# EAGLE design ESP32-Mini1-OSHPARK (EAGLE 9.6.2)
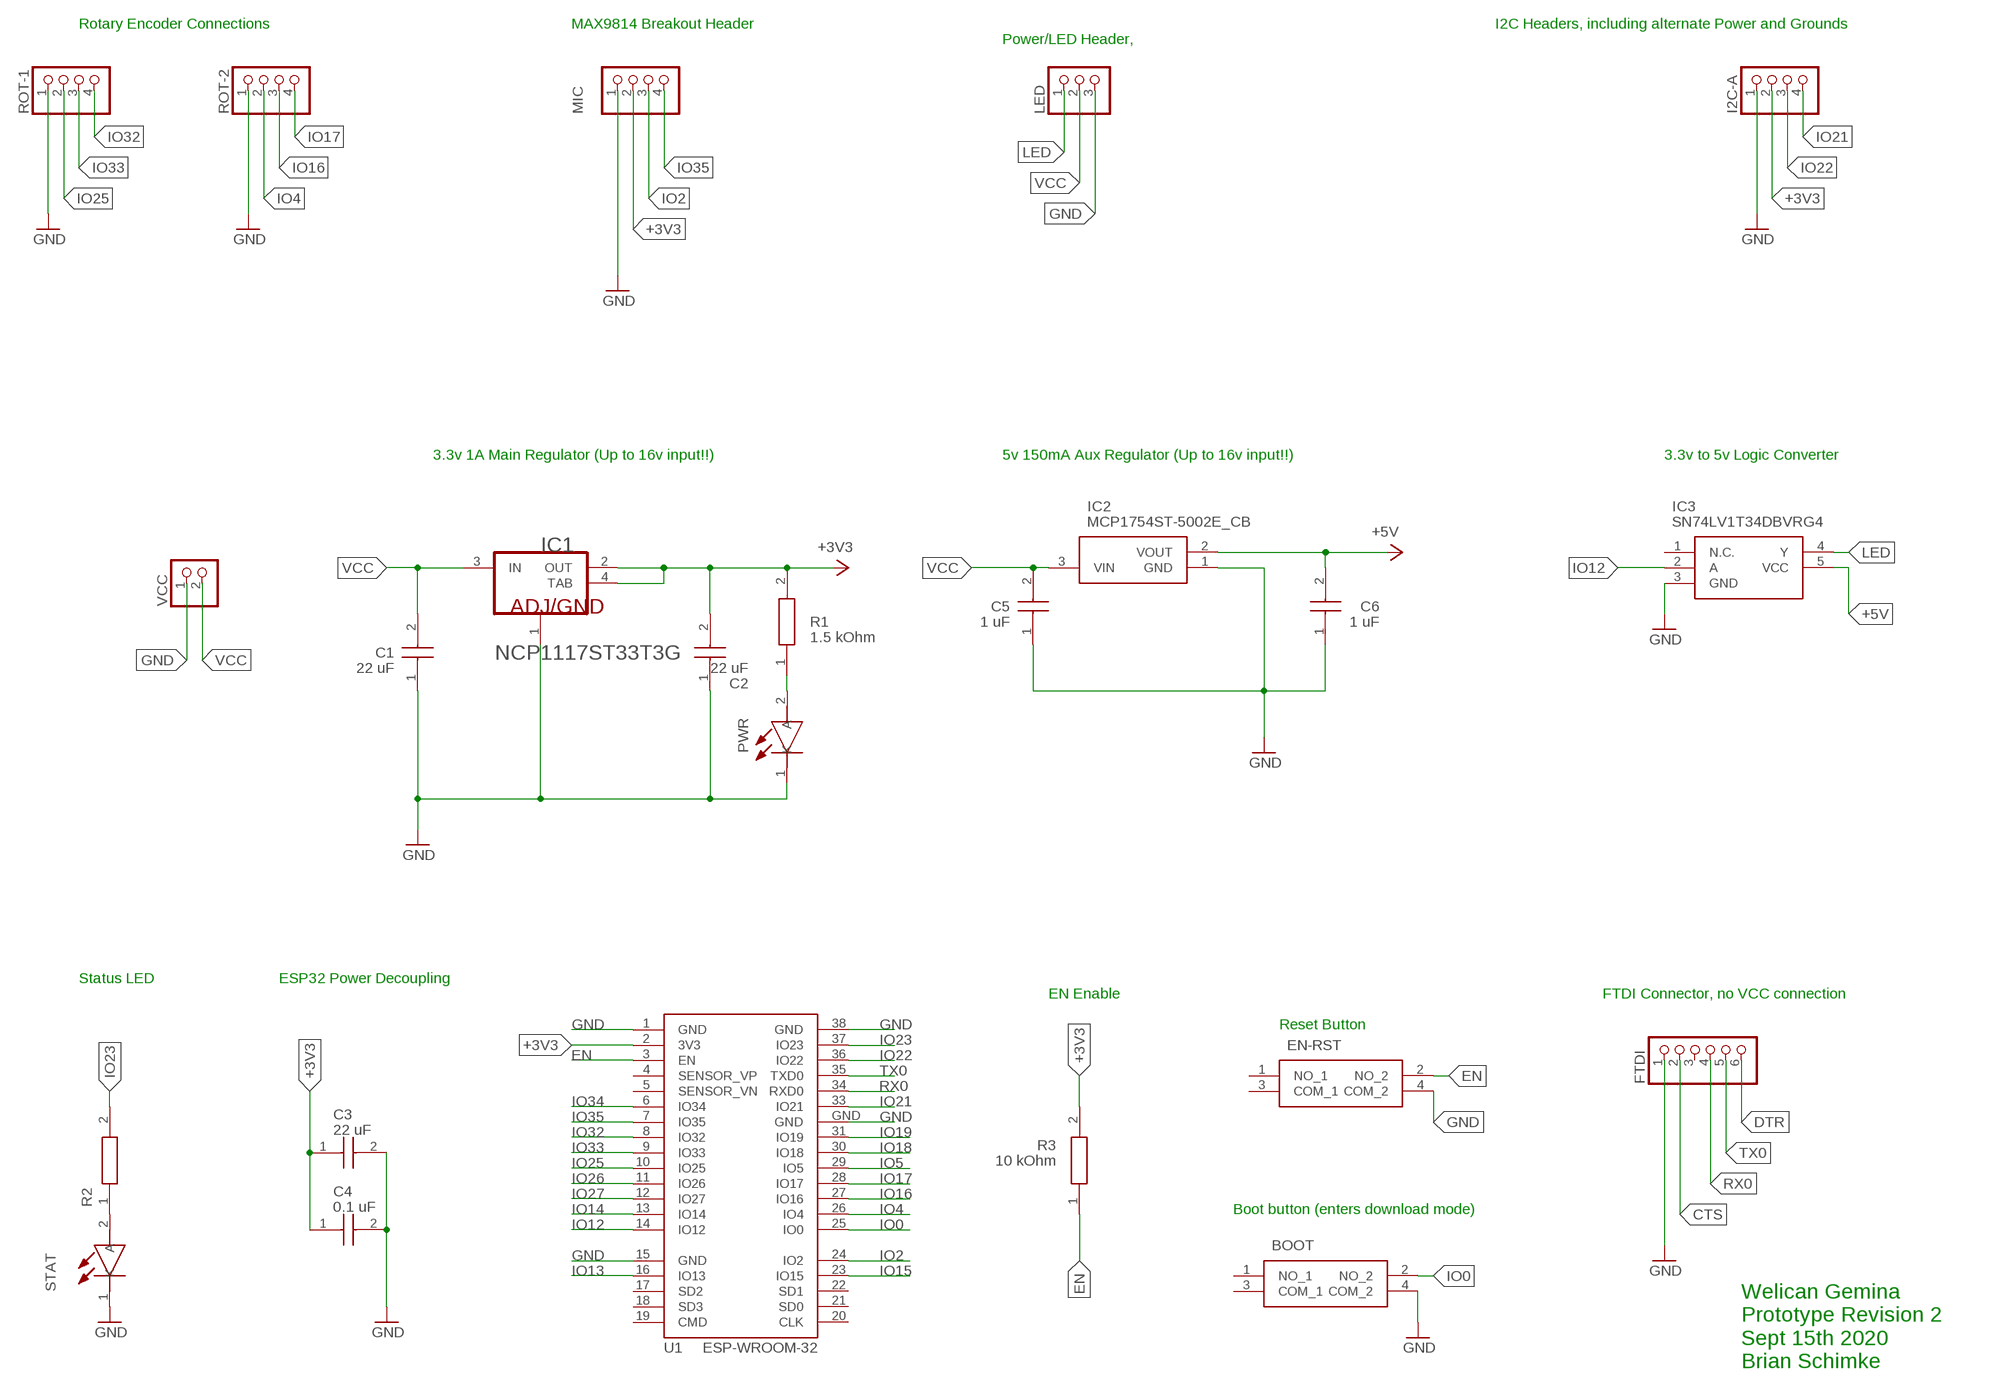
[diagram p0: schematic, sheet 1]

## Parts
BOOT  PTS647SK70SMTR2LFS  [PTS647SK70SMTR2LFS]
C1  22 uF  C1206C226M4PACTU  [CAPC3216X180N]
C2  22 uF  C1206C226M4PACTU  [CAPC3216X180N]
C3  22 uF  C1206C226M4PACTU  [CAPC3216X180N]
C4  0.1 uF  C1206C226M4PACTU  [CAPC3216X180N]
C5  1 uF  C1206C226M4PACTU  [CAPC3216X180N]
C6  1 uF  C1206C226M4PACTU  [CAPC3216X180N]
EN-RST  PTS647SK70SMTR2LFS  [PTS647SK70SMTR2LFS]
FTDI  PINHD-1X6  [1X06]
I2C-A  PINHD-1X4  [1X04]
IC1  ON_SEMICONDUCTOR_NCP1117ST33T3GON_SEMICONDUCTOR_NCP1117ST33T3G_0_0  [ON_SEMICONDUCTOR_NCP1117ST33T3G_0]
IC2  MCP1754ST-5002E_CB  [SOT95P255X145-3N]
IC3  SN74LV1T34DBVRG4  [SOT95P280X145-5N]
LED  PINHD-1X3  [1X03]
MIC  PINHD-1X4  [1X04]
PWR  150120AS75000  [LEDSC320X160X78-2N]
R1  1.5 kOhm  CRCW12061K00FKEB  [RESC3216X60N]
R2  CRCW12061K00FKEB  [RESC3216X60N]
R3  10 kOhm  CRCW12061K00FKEB  [RESC3216X60N]
ROT-1  PINHD-1X4  [1X04]
ROT-2  PINHD-1X4  [1X04]
STAT  150120AS75000  [LEDSC320X160X78-2N]
U1  ESP-WROOM-32  [ESP-WROOM-32]
VCC  PINHD-1X2  [1X02]

## Nets
+3V3: C2.2 C3.1 C4.1 I2C-A.2 IC1.2(OUT) IC1.4(TAB) MIC.2 R1.2 R3.2 U1.2(3V3)
+5V: C6.2 IC2.2(VOUT) IC3.5(VCC)
CTS: FTDI.2
DTR: FTDI.6
EN: EN-RST.2(NO_2) R3.1 U1.3(EN)
GND: BOOT.4(COM_2) C1.1 C2.1 C3.2 C4.2 C5.1 C6.1 EN-RST.4(COM_2) FTDI.1 I2C-A.1 IC1.1(ADJ/GND) IC2.1(GND) IC3.3(GND) LED.3 MIC.1 PWR.1(K) ROT-1.1 ROT-2.1 STAT.1(K) U1.1(GND) U1.15(GND) U1.38(GND) U1.GND VCC.1
IO0: BOOT.2(NO_2) U1.25(IO0)
IO2: MIC.3 U1.24(IO2)
IO4: ROT-2.2 U1.26(IO4)
IO5: U1.29(IO5)
IO12: IC3.2(A) U1.14(IO12)
IO13: U1.16(IO13)
IO14: U1.13(IO14)
IO15: U1.23(IO15)
IO16: ROT-2.3 U1.27(IO16)
IO17: ROT-2.4 U1.28(IO17)
IO18: U1.30(IO18)
IO19: U1.31(IO19)
IO21: I2C-A.4 U1.33(IO21)
IO22: I2C-A.3 U1.36(IO22)
IO23: R2.2 U1.37(IO23)
IO25: ROT-1.2 U1.10(IO25)
IO26: U1.11(IO26)
IO27: U1.12(IO27)
IO32: ROT-1.4 U1.8(IO32)
IO33: ROT-1.3 U1.9(IO33)
IO34: U1.6(IO34)
IO35: MIC.4 U1.7(IO35)
LED: IC3.4(Y) LED.1
N$1: PWR.2(A) R1.1
N$2: R2.1 STAT.2(A)
RX0: FTDI.4 U1.34(RXD0)
TX0: FTDI.5 U1.35(TXD0)
VCC: C1.2 C5.2 IC1.3(IN) IC2.3(VIN) LED.2 VCC.2
Unconnected: BOOT.1(NO_1) BOOT.3(COM_1) EN-RST.1(NO_1) EN-RST.3(COM_1) FTDI.3 IC3.1(N.C.) U1.4(SENSOR_VP) U1.5(SENSOR_VN) U1.17(SD2) U1.18(SD3) U1.19(CMD) U1.20(CLK) U1.21(SD0) U1.22(SD1)

## Notes on the sheet
- Rotary Encoder Connections | MAX9814 Breakout Header | I2C Headers, including alternate Power and Grounds
- Power/LED Header,
- 3.3v 1A Main Regulator (Up to 16v input!!) | 5v 150mA Aux Regulator (Up to 16v input!!) | 3.3v to 5v Logic Converter
- Status LED | ESP32 Power Decoupling
- EN Enable | FTDI Connector, no VCC connection
- Reset Button
- Boot button (enters download mode)
- Welican Gemina
  Prototype Revision 2
  Sept 15th 2020
  Brian Schimke

## Library data of the parts
BOOT EN-RST = SamacSys_Parts:PTS647SK70SMTR2LFS: Tactile Switches 50mA 12VDC, 2.5N 7.0mm H, G leads Source: Datasheet <https:////www.ckswitches.com/media/2567/pts647.pdf>; DESCRIPTION: Tactile Switches 50mA 12VDC, 2.5N 7.0mm H, G leads; HEIGHT: 7.2mm; MANUFACTURER_NAME: C & K COMPONENTS; MANUFACTURER_PART_NUMBER: PTS647SK70SMTR2LFS; MOUSER_PART_NUMBER: 611-PTS647SK70SMTR2L; MOUSER_PRICE-STOCK: https://www.mouser.co.uk/ProductDetail/CK/PTS647SK70SMTR2LFS?qs=PqoDHHvF64%2FG2CdR6DYUFw%3D%3D
C1-C6 = SamacSys_Parts:C1206C226M4PACTU: KEMET 1206 (3216M) 22uF MLCC 16V dc +/-20% SMD C1206C226M4PACTU Source: Datasheet <https://api.kemet.com/component-edge/download/specsheet/C1206C226M4PACTU.pdf>; DESCRIPTION: KEMET 1206 (3216M) 22uF MLCC 16V dc +/-20% SMD C1206C226M4PACTU; HEIGHT: 1.8mm; MANUFACTURER_NAME: Kemet; MANUFACTURER_PART_NUMBER: C1206C226M4PACTU; MOUSER_PART_NUMBER: 80-C1206C226M4P; MOUSER_PRICE-STOCK: https://www.mouser.co.uk/ProductDetail/KEMET/C1206C226M4PACTU?qs=vBH1GPjCw2UZFSd%252B4IU1Qg%3D%3D
FTDI = pinhead:PINHD-1X6: PIN HEADER
I2C-A MIC ROT-1 ROT-2 = pinhead:PINHD-1X4: PIN HEADER
IC1 = ON Semiconductor - NCP1117ST33T3G:ON_SEMICONDUCTOR_NCP1117ST33T3G: ONSC-NCP1117-SOT223-4; CASE_CODE_IMPERIAL: 0603; CASE_CODE_METRIC: 1608; CASE_PACKAGE: 0603; CIIVA_IDS: 19354120; COMPONENT_LINK_1_DESCRIPTION: Manufacturer URL; COMPONENT_LINK_1_URL: http://www.onsemi.com/; DATASHEET: http://www.onsemi.com/pub_link/Collateral/NCP1117-D.PDF; DATASHEET_VERSION: Rev. 27, 09/2014; FOOTPRINT_VARIANT_NAME_0: Manufacturer Recommended; HEIGHT: 0.45 mm; IMPORTED: yes; IMPORTED_FROM: vault; IMPORT_TS: 1521845423; LENGTH: 1.55 mm; MAX_OPERATING_TEMPERATURE: 155 degC; MF: ON Semiconductor; MIN_OPERATING_TEMPERATURE: -55 degC; MOUNT: Surface Mount; MPN: NCP1117ST33T3G; PACKAGE: SOT-223-4-318H-01_A; PACKAGE_DESCRIPTION: 4-Pin Small Outline Transistor, Body 6.5 x 3.5 mm, Pitch 2.3 mm; PACKAGE_QUANTITY: 5000; PACKAGING: Tape and Reel; POWER_RATING: 100 mW; PREFIX: U; RADIATION_HARDENING: No; REACH_SVHC: Unknown; RELEASE_DATE: 1475065185; RESISTANCE: 220 kohm; RO_HSCOMPLIANT: true; TOLERANCE: 1%; TYPE_RESISTOR: Thick Film; VAULT_GUID: C6E429D0-32F2-4CA3-9C68-29F3FC9DADEB; VAULT_REVISION: 6AD56B9F-4B97-41F2-91E8-97C557B92B31; VOLTAGE_RATING: 75 V; WEIGHT: 7.1E-05 oz; WIDTH: 0.85 mm
IC2 = SamacSys_Parts:MCP1754ST-5002E_CB: LDO regulator,voltage,5.0V,150mA,SOT23A Microchip MCP1754ST-5002E/CB, Single Linear Voltage Regulator, 150mA 5 V, 2%, 3-Pin SOT-23A Source: Datasheet; DESCRIPTION: LDO regulator,voltage,5.0V,150mA,SOT23A Microchip MCP1754ST-5002E/CB, Single Linear Voltage Regulator, 150mA 5 V, 2%, 3-Pin SOT-23A; HEIGHT: 1.45mm; MANUFACTURER_NAME: Microchip; MANUFACTURER_PART_NUMBER: MCP1754ST-5002E/CB; MOUSER_PART_NUMBER: 579-MCP1754T-5002ECB; MOUSER_PRICE-STOCK: https://www.mouser.co.uk/ProductDetail/Microchip-Technology/MCP1754ST-5002E-CB?qs=geWWqIMx8YpBnNSotTcMsA%3D%3D
IC3 = SamacSys_Parts:SN74LV1T34DBVRG4: Single Power Supply BUFFER Logic Level Shifter (no enable) Source: Datasheet <http://www.ti.com/lit/gpn/sn74lv1t34>; DESCRIPTION: Single Power Supply BUFFER Logic Level Shifter (no enable); HEIGHT: 1.45mm; MANUFACTURER_NAME: Texas Instruments; MANUFACTURER_PART_NUMBER: SN74LV1T34DBVRG4; MOUSER_PART_NUMBER: 595-SN74LV1T34DBVRG4; MOUSER_PRICE-STOCK: https://www.mouser.co.uk/ProductDetail/Texas-Instruments/SN74LV1T34DBVRG4?qs=vdi0iO8H4N10R%252Bt%252BjmxZrg%3D%3D
LED = pinhead:PINHD-1X3: PIN HEADER
PWR STAT = SamacSys_Parts:150120AS75000: WL-SMCW SMD chip LED top view monocolor%D waterclear Source: Datasheet <http://katalog.we-online.com/led/datasheet/150120AS75000.pdf>; DESCRIPTION: WL-SMCW SMD chip LED top view monocolor%D waterclear; HEIGHT: mm; MANUFACTURER_NAME: Wurth Elektronik; MANUFACTURER_PART_NUMBER: 150120AS75000; MOUSER_PART_NUMBER: 710-150120AS75000; MOUSER_PRICE-STOCK: https://www.mouser.co.uk/ProductDetail/Wurth-Elektronik/150120AS75000?qs=LlUlMxKIyB3dthGDbNsiXQ%3D%3D
R1-R3 = SamacSys_Parts:CRCW12061K00FKEB: Thick Film Resistors - SMD 1/4watt 1Kohms 1% Source: Datasheet <http://www.vishay.com/docs/20035/dcrcwe3.pdf>; DESCRIPTION: Thick Film Resistors - SMD 1/4watt 1Kohms 1%; HEIGHT: 0.6mm; MANUFACTURER_NAME: Vishay; MANUFACTURER_PART_NUMBER: CRCW12061K00FKEB; MOUSER_PART_NUMBER: 71-CRCW12061K00FKEB; MOUSER_PRICE-STOCK: https://www.mouser.co.uk/ProductDetail/Vishay-Dale/CRCW12061K00FKEB?qs=3XLFQ9LoC1wOYUVdt2fbOg%3D%3D
U1 = esp32:ESP-WROOM-32: Espressif Systems ESP-WROOM-32
VCC = pinhead:PINHD-1X2: PIN HEADER

## Board
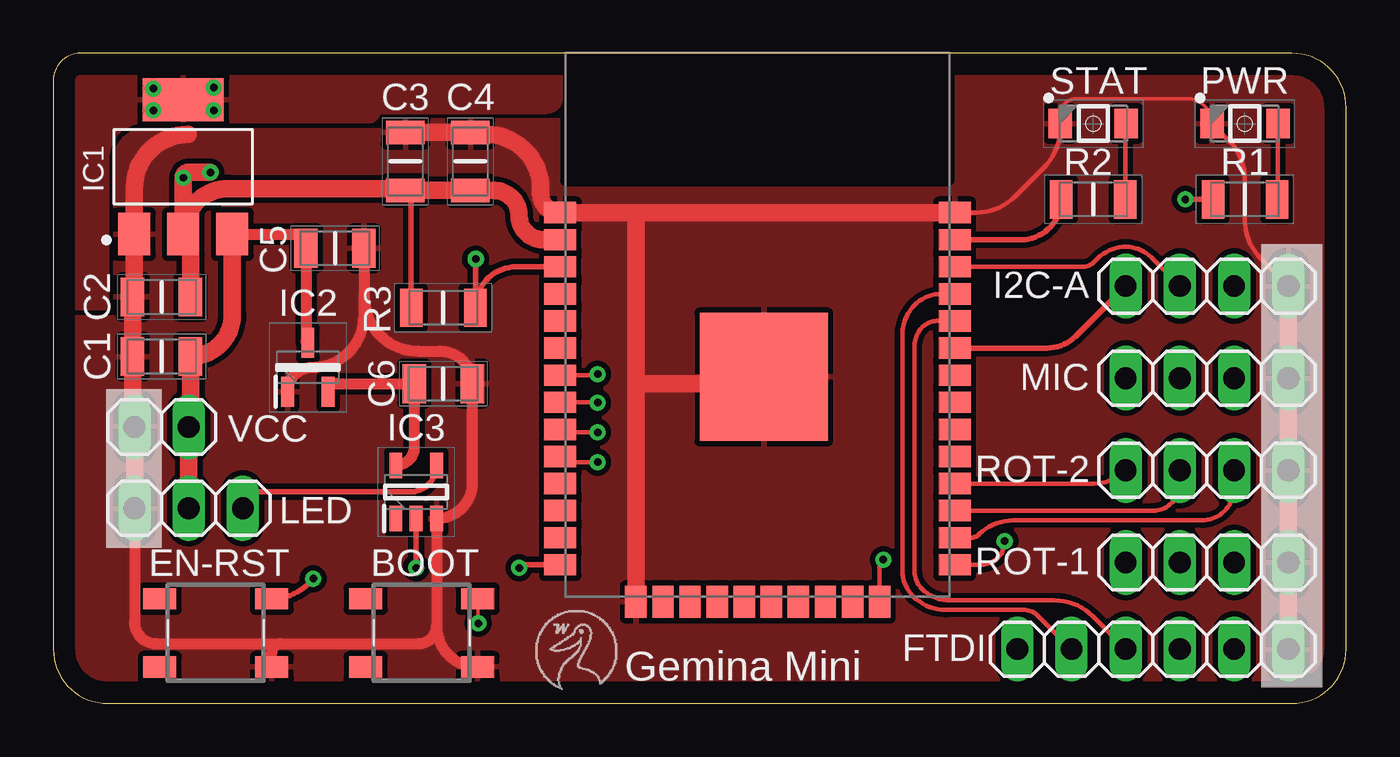
[diagram p1: board, top side]
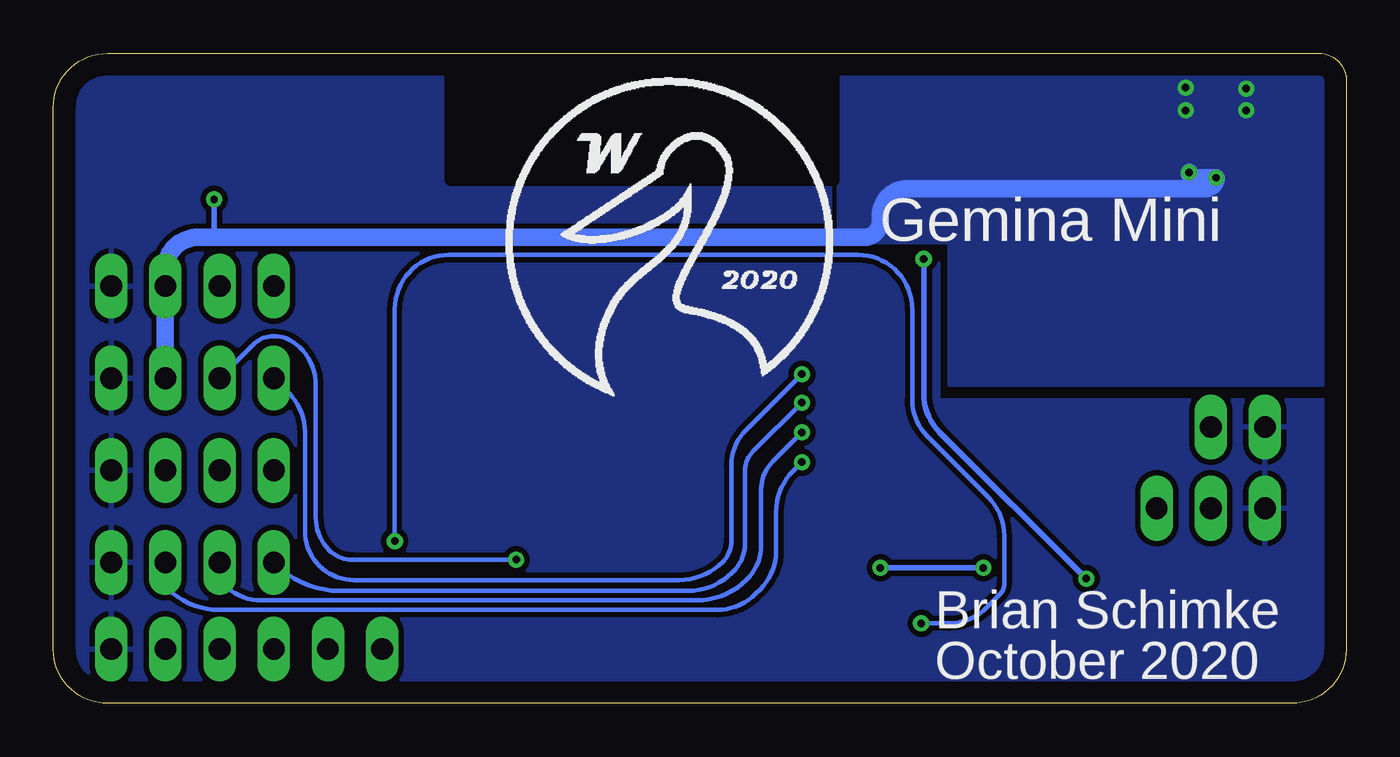
[diagram p2: board, bottom side, seen from below]

Size 60.63 x 30.47 mm. Coordinates in mm from the lower left corner, seen from the top.
Outline: 58.09,30.47 1.27,30.47 arc90 0,29.2 0,2.54 arc90 2.54,0 58.09,0 arc90 60.63,2.54 60.63,27.93 arc90 58.09,30.47
Copper layers (1*16): Top 0.035mm / dielectric 1.5mm / Bottom 0.035mm
Design rules "default": minimum track width 6mil, minimum drill 0.35mm, track to track 6mil, track to pad 6mil, pad to pad 6mil, via to via 6mil, smd to smd 6mil, copper to edge 40mil, drill to drill 6mil, minimum pad ring 10mil, minimum via ring 8mil, stop-mask expansion 4mil, vias tented up to drill 0mil, thermal gap 10mil

### Footprints (pad centres in the part's own frame; a part is rotated, then mirrored left to right if it is on the bottom)
PTS647SK70SMTR2LFS = smd 1.55 x 1: 1 -2.625,1.6; 2 2.625,1.6; 3 -2.625,-1.6; 4 2.625,-1.6
CAPC3216X180N = smd 1.1 x 1.82: 1 -1.36,0; 2 1.36,0
1X06 = drill 1.016 long: 1 -6.35,0; 2 -3.81,0; 3 -1.27,0; 4 1.27,0; 5 3.81,0; 6 6.35,0
1X04 = drill 1.016 long: 1 -3.81,0; 2 -1.27,0; 3 1.27,0; 4 3.81,0
ON_SEMICONDUCTOR_NCP1117ST33T3G_0 = smd 2 x 1.5: 1 -3.15,2.3; 2 -3.15,0; 3 -3.15,-2.3 | smd 2 x 3.8: 4 3.15,0
SOT95P255X145-3N = smd 1.4 x 0.6: 1 -1.15,0.95; 2 -1.15,-0.95; 3 1.15,0
SOT95P280X145-5N = smd 1.2 x 0.6: 1 -1.25,0.95; 2 -1.25,0; 3 -1.25,-0.95; 4 1.25,-0.95; 5 1.25,0.95
1X03 = drill 1.016 long: 1 -2.54,0; 2 0,0; 3 2.54,0
LEDSC320X160X78-2N = smd 1.1 x 1.4: 1 -1.55,0; 2 1.55,0
RESC3216X60N = smd 1.05 x 1.8: 1 -1.5,0; 2 1.5,0
ESP-WROOM-32 = smd 1.5 x 1: 1 -9.25,7; 2 -9.25,5.73; 3 -9.25,4.46; 4 -9.25,3.19; 5 -9.25,1.92; 6 -9.25,0.65; 7 -9.25,-0.62; 8 -9.25,-1.89; 9 -9.25,-3.16; 10 -9.25,-4.43; 11 -9.25,-5.7; 12 -9.25,-6.97; 13 -9.25,-8.24; 14 -9.25,-9.51; 25 9.25,-9.51; 26 9.25,-8.24; 27 9.25,-6.97; 28 9.25,-5.7; 29 9.25,-4.43; 30 9.25,-3.16; 31 9.25,-1.89; 32 9.25,-0.62; 33 9.25,0.65; 34 9.25,1.92; 35 9.25,3.19; 36 9.25,4.46; 37 9.25,5.73; 38 9.25,7 | smd 1 x 1.5: 15 -5.7,-11.25; 16 -4.43,-11.25; 17 -3.16,-11.25; 18 -1.89,-11.25; 19 -0.62,-11.25; 20 0.65,-11.25; 21 1.92,-11.25; 22 3.19,-11.25; 23 4.46,-11.25; 24 5.73,-11.25 | smd 6 x 6: GND 0.3,-0.7
1X02 = drill 1.016 long: 1 -1.27,0; 2 1.27,0

### Placement (x,y rotation side)
BOOT  17.27,3.3 0 top
C1  5.08,16.26 0 top
C2  5.08,19.05 0 top
C3  16.51,25.4 90 top
C4  19.56,25.4 90 top
C5  13.21,21.34 180 top
C6  18.29,14.99 180 top
EN-RST  7.62,3.3 0 top
FTDI  51.56,2.54 180 top
I2C-A  54.1,19.56 180 top
IC1  6.1,25.15 90 top
IC2  11.94,15.75 90 top
IC3  17.02,9.91 90 top
LED  6.35,9.14 180 top
MIC  54.1,15.24 180 top
PWR  55.88,27.18 0 top
R1  55.88,23.62 180 top
R2  48.77,23.62 180 top
R3  18.29,18.54 180 top
ROT-1  54.1,6.6 180 top
ROT-2  54.1,10.92 180 top
STAT  48.77,27.18 0 top
U1  33.02,16 0 top
VCC  5.08,12.95 0 top

### Tracks (layer width: path | path; a pad name or v marks a point on that pad's centre or on a via)
+3V3  (via drill 0.35)
  Top 0.254: IC1.2 6.44,21.65 | C3.1 arc-90 16.79,23.76 R3.2 | R1.2 v53.09,23.62
  Top 0.813: IC1.2 arc-90 8.23,24.13 16.42,24.13 arc-90 C3.1 C4.1 20.66,24.04 arc-90 21.84,22.86 arc90 22.97,21.73 U1.2 | C2.2 6.44,21.65 arc90 IC1.2 | IC1.2 v6.1,24.64 arc-90 6.35,24.89 v7.37,24.89
  Bottom 0.254: v53.09,23.62 53.09,21.84
  Bottom 0.813: v7.37,24.89 arc-90 7.11,24.64 v6.1,24.64 arc90 6.6,24.13 20.57,24.13 arc-90 21.84,22.86 21.84,22.61 arc90 22.61,21.84 53.09,21.84 53.85,21.84 arc-90 55.37,20.32 I2C-A.2 MIC.2
  other vias: 4.69,28.81 4.69,27.8 7.52,27.8 7.52,28.86
  pour Top: 4.26,27.29 arc90 2.53,25.55 2.53,21.24 2.53,18.74 arc-90 2.32,18.53 0.45,18.53 arc-90 0.2,18.78 0.2,26.78 0.2,29.32 arc-90 1.17,30.3 2.19,30.3 19.38,30.3 23.49,30.3 arc-90 23.78,30 23.78,29.87 23.78,28.35 arc-90 23.19,27.76 23.11,27.76 arc-90 23.06,27.71 15.23,27.71 arc-90 14.81,27.29 arc90 14.76,27.33 arc-90 14.72,27.29 4.48,27.29 4.31,27.29
  pour Bottom (isolate 0.254): 1.13,29.41 23.78,29.41 23.78,21.62 18.62,21.62 18.62,14.93 1.09,14.93 1.09,29.41
+5V
  Top 0.508: IC2.2 arc-90 13.28,14.99 C6.2 16.93,12.02 arc-90 IC3.5
EN  (via drill 0.35)
  Top 0.254: U1.3 21.71,20.46 arc90 R3.1 arc45 19.81,18.6 v19.81,20.83 | EN-RST.2 arc45 11.96,5.61 v12.19,5.84
  Bottom 0.254: v12.19,5.84 19.07,12.72 arc45 19.81,14.51 v19.81,20.83
GND
  Top 0.152: STAT.1 47.22,27.57 arc-90 48,28.35 53.16,28.35 arc-90 PWR.1
  Top 0.203: U1.38 43.29,23 arc45 45.08,23.75 46.47,25.14 arc45 47.22,26.93 STAT.1 | PWR.1 55.14,26.37 arc-45 55.88,24.58 55.88,22.64 arc45 56.62,20.85 I2C-A.1
  Top 0.254: 3.81,16.17 C1.1
  Top 0.508: IC2.1 arc-90 12.14,15.75 arc90 14.57,18.18 14.57,19.05 | C5.1 14.57,19.05 | 14.57,19.05 arc90 17.11,16.51 18.12,16.51 arc-90 C6.1 19.65,10.34 arc-90 IC3.3 17.97,3.63 | 17.97,3.63 arc90 BOOT.4 | EN-RST.4 10.24,2.37 arc-90 10.67,2.79 | 10.67,2.79 17.13,2.79 arc90 17.97,3.63 | LED.3 3.81,3.81 arc90 4.83,2.79 10.67,2.79
  Top 0.813: 6.34,26.67 arc90 3.8,24.13 IC1.1 3.8,19.13 arc-90 C2.1 C1.1 | C3.2 C4.2 arc90 19.65,26.67 20.32,26.67 arc-90 22.86,24.13 22.86,23.88 arc90 23.73,23 U1.1 27.43,23 | C1.1 arc90 3.81,16.17 | C1.1 3.72,13.04 arc90 VCC.1 LED.3 | U1.15 27.32,14.99 | U1.38 27.43,23 | U1.GND arc-90 33,14.99 27.32,14.99 | 27.32,14.99 27.32,22.89 arc-90 27.43,23 | I2C-A.1 MIC.1 ROT-2.1 ROT-1.1 FTDI.1
  pour Top (isolate 0.254): 4.31,26.87 15.65,26.87 15.65,27.33 24.21,27.33 24.21,30.3 60.66,30.3 60.66,0.11 0.07,0.11 0.07,18.1 2.91,18.1 2.91,25.47 arc-90
  pour Bottom (isolate 0.254): 1.05,14.21 19.13,14.21 19.13,21.02 24.21,21.02 24.21,24.37 42.24,24.37 42.24,29.41 59.56,29.41 59.56,1 1.05,1
IO0  (via drill 0.35)
  Top 0.152: v19.93,3.75 19.93,4.82 arc45 BOOT.2
  Top 0.203: U1.25 43.51,6.49 arc90 v44.61,7.6
  Bottom 0.203: v44.61,7.6 44.61,18.48 arc90 42.07,21.02 41.14,21.02 40.89,21.02 22.89,21.02 arc90 20.35,18.48 20.35,14.21 arc-45 19.66,12.54 16.78,9.66 arc45 16.03,7.86 16.03,5.61 arc45 16.25,5.1 16.86,4.49 arc45 18.65,3.75 v19.93,3.75
IO2  (via drill 0.35)
  Top 0.203: U1.24 38.75,6.31 arc-45 v38.93,6.73
  Bottom 0.203: MIC.3 51.27,16.8 arc45 50.29,17.21 arc45 49.1,16.71 49.07,16.68 arc45 48.32,14.89 48.32,8.71 arc-45 47.69,7.18 arc-45 46.62,6.73 v38.93,6.73
IO4
  Top 0.203: ROT-2.2 55.37,10.09 arc-45 54.93,9.02 arc-45 53.85,8.57 44.97,8.57 arc45 43.43,7.94 arc-45 43.01,7.76 U1.26
IO12  (via drill 0.35)
  Top 0.254: U1.14 22.19,6.49 arc45 v21.84,6.35 | IC3.2 v17.02,6.35
  Bottom 0.254: v21.84,6.35 v17.02,6.35
IO16
  Top 0.203: U1.27 51.57,9.03 arc45 52.45,9.4 arc45 52.83,10.32 ROT-2.3
  Top 0.254: U1.27 arc45 42.76,9.24
IO17
  Top 0.203: U1.28 48.79,10.3 arc45 ROT-2.4
IO21
  Top 0.254: U1.33 46.59,16.65 arc45 47.95,17.22 I2C-A.4
IO22
  Top 0.203: I2C-A.3 51.48,20.91 arc45 50.29,21.4 arc45 48.99,20.86 48.83,20.7 arc-45 48.25,20.46 U1.36
IO23
  Top 0.254: U1.37 45.38,21.73 arc90 R2.2
IO25  (via drill 0.35)
  Top 0.203: U1.10 arc45 24.42,11.3 v25.53,11.3
  Bottom 0.203: 55.37,5.69 arc-45 55.24,5.37 arc-45 52.86,4.38 29.5,4.38 arc-45 27.7,5.13 27.48,5.35 arc-45 26.73,7.15 26.73,8.98 arc45 25.94,10.89 v25.53,11.3
  Bottom 0.254: 55.37,5.69 ROT-1.2
IO32  (via drill 0.35)
  Top 0.203: U1.8 25.49,14.11 arc45 v25.53,14.1
  Bottom 0.203: v25.53,14.1 27.81,11.82 arc-45 28.19,10.89 28.19,7.49 arc45 28.73,6.19 28.79,6.13 arc45 30.87,5.27 47.2,5.27 arc45 50.2,6.52 ROT-1.4
IO33  (via drill 0.35)
  Top 0.203: v25.53,12.7 24.11,12.7 arc-45 U1.9
  Bottom 0.203: 52.62,5.56 arc-45 50.86,4.83 30.45,4.83 arc-45 28.11,5.79 28.1,5.81 arc-45 27.43,7.42 27.43,10.03 arc45 26.89,11.33 v25.53,12.7
  Bottom 0.254: 52.62,5.56 arc45 52.83,6.06 ROT-1.3
IO35  (via drill 0.35)
  Top 0.203: U1.7 25.41,15.38 arc45 v25.53,15.43
  Bottom 0.203: v25.53,15.43 28.16,12.8 arc-45 28.83,11.18 28.83,7.62 arc45 29.24,6.62 arc45 31.28,5.78 46.54,5.78 arc45 48.15,6.45 arc45 48.83,8.08 48.83,12.73 arc-45 49.58,14.52 MIC.4
LED
  Top 0.254: IC3.4 arc-90 16.72,9.91 8.89,9.91 LED.1
N$1
  Top 0.203: PWR.2 57.43,23.74 arc-45 R1.1
N$2
  Top 0.203: STAT.2 arc45 50.27,27.06 R2.1
RX0
  Top 0.203: U1.34 41.42,17.92 arc45 40.77,17.65 arc45 40.39,16.73 40.39,6.22 arc45 40.74,5.37 arc45 42.04,4.83 46.95,4.83 arc-45 48.75,4.08 FTDI.4
TX0
  Top 0.203: FTDI.5 46.22,4.07 arc45 45.47,4.38 41.86,4.38 arc-45 40.32,5.02 arc-45 39.81,6.24 39.81,17.29 arc-45 40.39,18.67 arc-45 41.65,19.19 U1.35
VCC
  Top 0.508: IC1.3 11.19,22 arc-90 C5.2 11.85,16.99 arc90 IC2.3
  Top 0.813: IC1.3 8.4,18.21 arc-90 C1.2 6.44,13.04 arc-90 VCC.2 LED.2

### Text on the board
tPlace: Gemina Mini
bPlace: Gemina Mini | Brian Schimke | October 2020